# EAGLE design Test_Board (EAGLE 6.5.0)
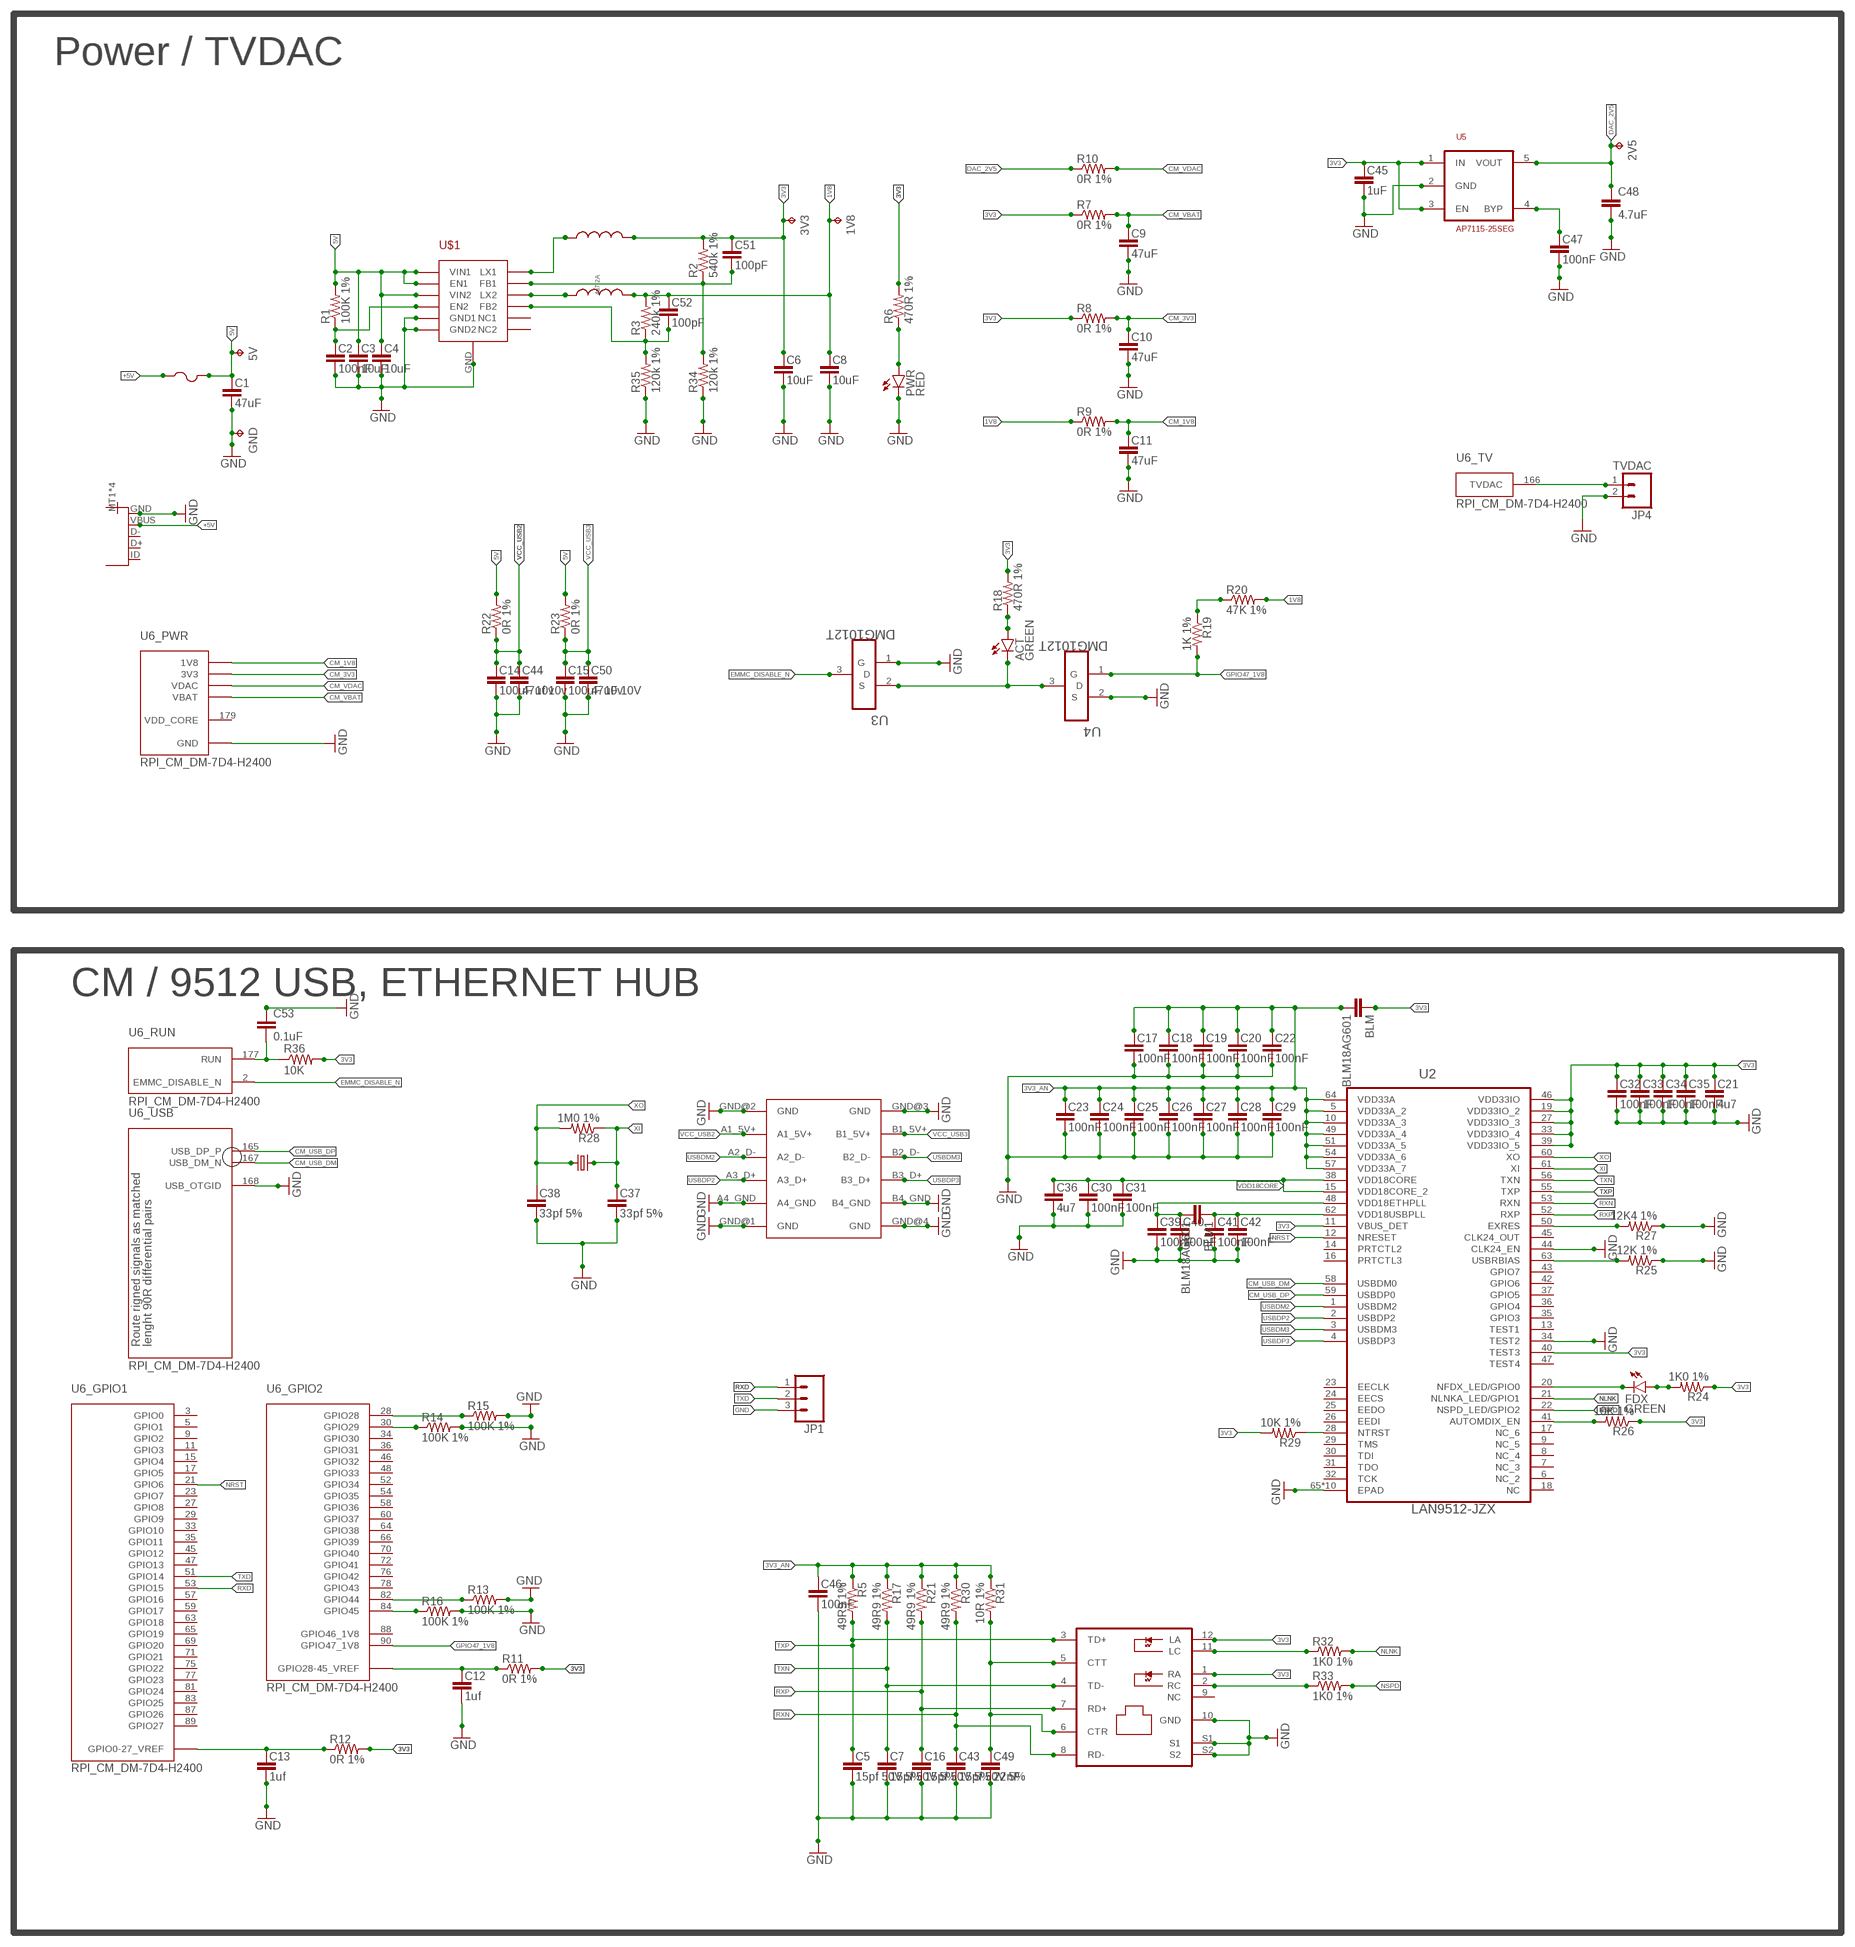
[diagram p0: schematic, sheet 1]

## Parts
1V8  TPB1,27  [B1,27]
2V5  TPB1,27  [B1,27]
3V3  TPB1,27  [B1,27]
5V  TPB1,27  [B1,27]
ACT  GREEN  LED0603  [LED-0603]
BLM  BLM18AG601  0.1UF-25V-5%(0603)  [0603-CAP]
BLM1  BLM18AG601  0.1UF-25V-5%(0603)  [0603-CAP]
C1  47uF  C_1206  [1206]
C2  100nF  C_0402  [0402]
C3  10uF  C_0805  [0805]
C4  10uF  C_0805  [0805]
C5  15pf 50V 5%  C_0402  [0402]
C6  10uF  C_0805  [0805]
C7  15pf 50V 5%  C_0402  [0402]
C8  10uF  C_0805  [0805]
C9  47uF  C_1206  [1206]
C10  47uF  C_1206  [1206]
C11  47uF  C_1206  [1206]
C12  1uf  C_0402  [0402]
C13  1uf  C_0402  [0402]
C14  100uF 10v  C_1206  [1206]
C15  100uF 10v  C_1206  [1206]
C16  15pf 50V 5%  C_0402  [0402]
C17  100nF  C_0402  [0402]
C18  100nF  C_0402  [0402]
C19  100nF  C_0402  [0402]
C20  100nF  C_0402  [0402]
C21  4u7  C_0402  [0402]
C22  100nF  C_0402  [0402]
C23  100nF  C_0402  [0402]
C24  100nF  C_0402  [0402]
C25  100nF  C_0402  [0402]
C26  100nF  C_0402  [0402]
C27  100nF  C_0402  [0402]
C28  100nF  C_0402  [0402]
C29  100nF  C_0402  [0402]
C30  100nF  C_0402  [0402]
C31  100nF  C_0402  [0402]
C32  100nF  C_0402  [0402]
C33  100nF  C_0402  [0402]
C34  100nF  C_0402  [0402]
C35  100nF  C_0402  [0402]
C36  4u7  C_0402  [0402]
C37  33pf 5%  C_0402  [0402]
C38  33pf 5%  C_0402  [0402]
C39  100nF  C_0402  [0402]
C40  100nF  C_0402  [0402]
C41  100nF  C_0402  [0402]
C42  100nF  C_0402  [0402]
C43  15pf 50V 5%  C_0402  [0402]
C44  47uf 10v  C_0805  [0805]
C45  1uF  C_0402  [0402]
C46  100nF  C_0402  [0402]
C47  100nF  C_0402  [0402]
C48  4.7uF  4.7UF-6.3V-10%(0603)0603  [0603-CAP]
C49  22nF  C_0805  [0805]
C50  47uF 10V  C_0805  [0805]
C51  100pF  C_0402  [0402]
C52  100pF  C_0402  [0402]
C53  0.1uF  0.1UF-25V-5%(0603)  [0603-CAP]
F1  PTCFUSE-1812  [1812]
FDX  GREEN  LED0603  [LED-0603]
GND  TPB1,27  [B1,27]
J1  J3011  [J30]
JP1  M03PTH  [1X03]
JP3  USB-IDMICRO  [USB-MICRO]
JP4  TVDAC  M02PTH  [1X02]
L1  4.7u 2A  INDUCTOR-SRN4018  [SRN4018]
L2  4.7u 2A  INDUCTOR-SRN4018  [SRN4018]
PWR  RED  LED0603  [LED-0603]
R1  100K 1%  RESISTOR0402-RES  [0402-RES]
R2  540k 1%  RESISTOR0402-RES  [0402-RES]
R3  240k 1%  RESISTOR0402-RES  [0402-RES]
R5  49R9 1%  RESISTOR0402-RES  [0402-RES]
R6  470R 1%  RESISTOR0402-RES  [0402-RES]
R7  0R 1%  RESISTOR0402-RES  [0402-RES]
R8  0R 1%  RESISTOR0402-RES  [0402-RES]
R9  0R 1%  RESISTOR0402-RES  [0402-RES]
R10  0R 1%  RESISTOR0402-RES  [0402-RES]
R11  0R 1%  RESISTOR0402-RES  [0402-RES]
R12  0R 1%  RESISTOR0402-RES  [0402-RES]
R13  100K 1%  RESISTOR0402-RES  [0402-RES]
R14  100K 1%  RESISTOR0402-RES  [0402-RES]
R15  100K 1%  RESISTOR0402-RES  [0402-RES]
R16  100K 1%  RESISTOR0402-RES  [0402-RES]
R17  49R9 1%  RESISTOR0402-RES  [0402-RES]
R18  470R 1%  RESISTOR0402-RES  [0402-RES]
R19  1K 1%  RESISTOR0402-RES  [0402-RES]
R20  47K 1%  RESISTOR0402-RES  [0402-RES]
R21  49R9 1%  RESISTOR0402-RES  [0402-RES]
R22  0R 1%  RESISTOR0402-RES  [0402-RES]
R23  0R 1%  RESISTOR0402-RES  [0402-RES]
R24  1K0 1%  RESISTOR0402-RES  [0402-RES]
R25  12K 1%  RESISTOR0402-RES  [0402-RES]
R26  10K 1%  RESISTOR0402-RES  [0402-RES]
R27  12K4 1%  RESISTOR0402-RES  [0402-RES]
R28  1M0 1%  RESISTOR0402-RES  [0402-RES]
R29  10K 1%  RESISTOR0402-RES  [0402-RES]
R30  49R9 1%  RESISTOR0402-RES  [0402-RES]
R31  10R 1%  RESISTOR0402-RES  [0402-RES]
R32  1K0 1%  RESISTOR0402-RES  [0402-RES]
R33  1K0 1%  RESISTOR0402-RES  [0402-RES]
R34  120k 1%  RESISTOR0402-RES  [0402-RES]
R35  120k 1%  RESISTOR0402-RES  [0402-RES]
R36  10K  RESISTOR0402-RES  [0402-RES]
U2  LAN9512-JZX  [QFN50P900X900X100-65N]
U3  DMG1012T  [SOT50P160X90-3N]
U4  DMG1012T  [SOT50P160X90-3N]
U5  AP7115-25SEG  74LVC1G79GW  [SOT353]
U6  RPI_CM_DM-7D4-H2400  [JST-DM-200P]
U$1  WDFN-12L  [WDFN-12L]
USB1  72309USB-TYPE-A  [72309]
Y1  CRYSTAL5X3  [CRYSTAL-SMD-5X3]

## Nets
1V8: 1V8.TP C8.1 C52.1 L2.P$2 R3.2 R9.1 R20.2
3V3: 3V3.TP BLM.1 C6.1 C21.1 C32.1 C33.1 C34.1 C35.1 C45.1 C51.1 J1.1(RA) J1.12(LA) L1.P$2 R2.2 R6.2 R7.1 R8.1 R11.2 R12.2 R18.2 R24.1 R26.1 R29.2 R36.2 U2.11(VBUS_DET) U2.19(VDD33IO_2) U2.27(VDD33IO_3) U2.33(VDD33IO_4) U2.39(VDD33IO_5) U2.40(TEST3) U2.46(VDD33IO) U5.1(IN) U5.3(EN)
3V3_AN: BLM.2 C17.1 C18.1 C19.1 C20.1 C22.1 C23.1 C24.1 C25.1 C26.1 C27.1 C28.1 C29.1 C46.1 R5.1 R17.1 R21.1 R30.1 R31.1 U2.5(VDD33A_2) U2.10(VDD33A_3) U2.49(VDD33A_4) U2.51(VDD33A_5) U2.54(VDD33A_6) U2.57(VDD33A_7) U2.64(VDD33A)
5V: 5V.TP C1.1 C3.1 C4.1 F1.2 R1.2 R22.2 R23.2 U$1.1(VIN2) U$1.6(EN1) U$1.7(VIN1)
+5V: F1.1 JP3.VBUS
CM_1V8: C11.1 R9.2 U6.183(_PWR:1V8) U6.184(_PWR:1V8) U6.185(_PWR:1V8) U6.186(_PWR:1V8)
CM_3V3: C10.1 R8.2 U6.191(_PWR:3V3) U6.192(_PWR:3V3) U6.193(_PWR:3V3) U6.194(_PWR:3V3)
CM_USB_DM: U2.58(USBDM0) U6.167(_USB:USB_DM_N)
CM_USB_DP: U2.59(USBDP0) U6.165(_USB:USB_DP_P)
CM_VBAT: C9.1 R7.2 U6.197(_PWR:VBAT) U6.198(_PWR:VBAT) U6.199(_PWR:VBAT) U6.200(_PWR:VBAT)
CM_VDAC: R10.2 U6.189(_PWR:VDAC) U6.190(_PWR:VDAC)
DAC_2V5: 2V5.TP C48.1 R10.1 U5.5(VOUT)
EMMC_DISABLE_N: U3.3(D) U6.2(_RUN:EMMC_DISABLE_N)
GND: C1.2 C2.2 C3.2 C4.2 C5.2 C6.2 C7.2 C8.2 C9.2 C10.2 C11.2 C12.2 C13.2 C14.2 C15.2 C16.2 C17.2 C18.2 C19.2 C20.2 C21.2 C22.2 C23.2 C24.2 C25.2 C26.2 C27.2 C28.2 C29.2 C30.2 C31.2 C32.2 C33.2 C34.2 C35.2 C36.2 C37.2 C38.2 C39.2 C40.2 C41.2 C42.2 C43.2 C44.2 C45.2 C46.2 C47.2 C48.2 C49.2 C50.2 C53.1 GND.TP J1.10(GND) J1.S1 J1.S2 JP1.3 JP3.GND JP4.2 PWR.C R13.2 R14.2 R15.2 R16.2 R25.1 R27.1 R34.1 R35.1 U2.34(TEST2) U2.44(CLK24_EN) U2.65(EPAD) U2.GND@1(EPAD) U2.GND@2(EPAD) U2.GND@3(EPAD) U2.GND@4(EPAD) U2.GND@5(EPAD) U2.GND@6(EPAD) U2.GND@7(EPAD) U2.GND@8(EPAD) U2.GND@9(EPAD) U3.1(G) U4.2(S) U5.2(GND) U6.1(_PWR:GND) U6.7(_PWR:GND) U6.13(_PWR:GND) U6.19(_PWR:GND) U6.25(_PWR:GND) U6.26(_PWR:GND) U6.31(_PWR:GND) U6.32(_PWR:GND) U6.37(_PWR:GND) U6.38(_PWR:GND) U6.43(_PWR:GND) U6.44(_PWR:GND) U6.49(_PWR:GND) U6.50(_PWR:GND) U6.55(_PWR:GND) U6.56(_PWR:GND) U6.61(_PWR:GND) U6.62(_PWR:GND) U6.67(_PWR:GND) U6.68(_PWR:GND) U6.73(_PWR:GND) U6.74(_PWR:GND) U6.79(_PWR:GND) U6.80(_PWR:GND) U6.85(_PWR:GND) U6.86(_PWR:GND) U6.91(_PWR:GND) U6.92(_PWR:GND) U6.97(_PWR:GND) U6.98(_PWR:GND) U6.103(_PWR:GND) U6.104(_PWR:GND) U6.109(_PWR:GND) U6.110(_PWR:GND) U6.115(_PWR:GND) U6.116(_PWR:GND) U6.121(_PWR:GND) U6.122(_PWR:GND) U6.127(_PWR:GND) U6.133(_PWR:GND) U6.134(_PWR:GND) U6.139(_PWR:GND) U6.140(_PWR:GND) U6.145(_PWR:GND) U6.146(_PWR:GND) U6.151(_PWR:GND) U6.152(_PWR:GND) U6.157(_PWR:GND) U6.163(_PWR:GND) U6.164(_PWR:GND) U6.168(_USB:USB_OTGID) U6.169(_PWR:GND) U6.170(_PWR:GND) U6.181(_PWR:GND) U6.182(_PWR:GND) U6.187(_PWR:GND) U6.188(_PWR:GND) U6.195(_PWR:GND) U6.196(_PWR:GND) U$1.3(GND1) U$1.9(GND2) U$1.GND USB1.A4_GND USB1.B4_GND USB1.GND@1(GND) USB1.GND@2(GND) USB1.GND@3(GND) USB1.GND@4(GND)
GPI047_CTL_1V8: R19.1 R20.1
GPIO47_1V8: R19.2 U4.1(G) U6.90(_GPIO2:GPIO47_1V8)
N$1: L1.P$1 U$1.8(LX1)
N$2: C51.2 R2.1 R34.2 U$1.4(FB1)
N$3: C2.1 R1.1 U$1.12(EN2)
N$4: L2.P$1 U$1.2(LX2)
N$5: C12.1 R11.1 U6.41(_GPIO2:GPIO28-45_VREF) U6.42(_GPIO2:GPIO28-45_VREF)
N$6: C52.2 R3.1 R35.2 U$1.10(FB2)
N$7: PWR.A R6.1
N$8: C13.1 R12.1 U6.39(_GPIO1:GPIO0-27_VREF) U6.40(_GPIO1:GPIO0-27_VREF)
N$9: R15.1 U6.28(_GPIO2:GPIO28)
N$10: R14.1 U6.30(_GPIO2:GPIO29)
N$11: R13.1 U6.82(_GPIO2:GPIO44)
N$12: R16.1 U6.84(_GPIO2:GPIO45)
N$13: FDX.A R24.2
N$14: ACT.C U3.2(S) U4.3(D)
N$15: ACT.A R18.1
N$16: R25.2 U2.63(USBRBIAS)
N$17: C53.2 R36.1 U6.177(_RUN:RUN)
N$18: JP4.1 U6.166(_TV:TVDAC)
N$21: C47.1 U5.4(BYP)
N$22: BLM1.1 C41.1 C42.1 U2.62(VDD18USBPLL)
N$23: BLM1.2 C39.1 C40.1 U2.48(VDD18ETHPLL)
N$24: R26.2 U2.41(AUTOMDIX_EN)
N$25: R27.2 U2.50(EXRES)
N$26: R29.1 U2.28(NTRST)
N$27: J1.11(LC) R32.1
N$28: J1.2(RC) R33.1
N$29: C49.1 J1.5(CTT) J1.6(CTR) R31.2
N$30: FDX.C U2.20(NFDX_LED/GPIO0)
NLNK: R32.2 U2.21(NLNKA_LED/GPIO1)
NRST: U2.12(NRESET) U6.21(_GPIO1:GPIO6)
NSPD: R33.2 U2.22(NSPD_LED/GPIO2)
RXD: JP1.1 U6.53(_GPIO1:GPIO15)
RXN: C43.1 J1.8(RD-) R30.2 U2.53(RXN)
RXP: C16.1 J1.7(RD+) R21.2 U2.52(RXP)
TXD: JP1.2 U6.51(_GPIO1:GPIO14)
TXN: C7.1 J1.4(TD-) R17.2 U2.56(TXN)
TXP: C5.1 J1.3(TD+) R5.2 U2.55(TXP)
USBDM2: U2.1(USBDM2) USB1.A2_D-
USBDM3: U2.3(USBDM3) USB1.B2_D-
USBDP2: U2.2(USBDP2) USB1.A3_D+
USBDP3: U2.4(USBDP3) USB1.B3_D+
VCC_USB2: C14.1 C44.1 R22.1 USB1.A1_5V+
VCC_USB3: C15.1 C50.1 R23.1 USB1.B1_5V+
VDD18CORE: C30.1 C31.1 C36.1 U2.15(VDD18CORE_2) U2.38(VDD18CORE)
XI: C37.1 R28.1 U2.61(XI) Y1.3
XO: C38.1 R28.2 U2.60(XO) Y1.1
Unconnected: J1.9(NC) JP3.D+ JP3.D- JP3.ID JP3.MT1(SHELL) JP3.MT2(SHELL) JP3.P$1(SHELL) JP3.P$2(SHELL) U2.6(NC_2) U2.7(NC_3) U2.8(NC_4) U2.9(NC_5) U2.13(TEST1) U2.14(PRTCTL2) U2.16(PRTCTL3) U2.17(NC_6) U2.18(NC) U2.23(EECLK) U2.24(EECS) U2.25(EEDO) U2.26(EEDI) U2.29(TMS) U2.30(TDI) U2.31(TDO) U2.32(TCK) U2.35(GPIO3) U2.36(GPIO4) U2.37(GPIO5) U2.42(GPIO6) U2.43(GPIO7) U2.45(CLK24_OUT) U2.47(TEST4) U6.3(_GPIO1:GPIO0) U6.5(_GPIO1:GPIO1) U6.9(_GPIO1:GPIO2) U6.11(_GPIO1:GPIO3) U6.15(_GPIO1:GPIO4) U6.17(_GPIO1:GPIO5) U6.23(_GPIO1:GPIO7) U6.27(_GPIO1:GPIO8) U6.29(_GPIO1:GPIO9) U6.33(_GPIO1:GPIO10) U6.34(_GPIO2:GPIO30) U6.35(_GPIO1:GPIO11) U6.36(_GPIO2:GPIO31) U6.45(_GPIO1:GPIO12) U6.46(_GPIO2:GPIO32) U6.47(_GPIO1:GPIO13) U6.48(_GPIO2:GPIO33) U6.52(_GPIO2:GPIO34) U6.54(_GPIO2:GPIO35) U6.57(_GPIO1:GPIO16) U6.58(_GPIO2:GPIO36) U6.59(_GPIO1:GPIO17) U6.60(_GPIO2:GPIO37) U6.63(_GPIO1:GPIO18) U6.64(_GPIO2:GPIO38) U6.65(_GPIO1:GPIO19) U6.66(_GPIO2:GPIO39) U6.69(_GPIO1:GPIO20) U6.70(_GPIO2:GPIO40) U6.71(_GPIO1:GPIO21) U6.72(_GPIO2:GPIO41) U6.75(_GPIO1:GPIO22) U6.76(_GPIO2:GPIO42) U6.77(_GPIO1:GPIO23) U6.78(_GPIO2:GPIO43) U6.81(_GPIO1:GPIO24) U6.83(_GPIO1:GPIO25) U6.87(_GPIO1:GPIO26) U6.88(_GPIO2:GPIO46_1V8) U6.89(_GPIO1:GPIO27) U6.93(_DSI:DSI0_D1_N) U6.94(_DSI:DSI1_D0_P) U6.95(_DSI:DSI0_D1_P) U6.96(_DSI:DSI1_D0_N) U6.99(_DSI:DSI0_D0_N) U6.100(_DSI:DSI1_C_P) U6.101(_DSI:DSI0_D0_P) U6.102(_DSI:DSI1_C_N) U6.105(_DSI:DSI0_C_N) U6.106(_DSI:DSI1_D3_P) U6.107(_DSI:DSI0_C_P) U6.108(_DSI:DSI1_D3_N) U6.111(_HDMI:HDMI_CK_N) U6.112(_DSI:DSI1_D2_P) U6.113(_HDMI:HDMI_CK_P) U6.114(_DSI:DSI1_D2_N) U6.117(_HDMI:HDMI_D0_N) U6.118(_DSI:DSI1_D1_P) U6.119(_HDMI:HDMI_D0_P) U6.120(_DSI:DSI1_D1_N) U6.123(_HDMI:HDMI_D1_N) U6.125(_HDMI:HDMI_D1_P) U6.129(_HDMI:HDMI_D2_N) U6.131(_HDMI:HDMI_D2_P) U6.135(_CAM:CAM1_D3_P) U6.136(_CAM:CAM0_D0_P) U6.137(_CAM:CAM1_D3_N) U6.138(_CAM:CAM0_D0_N) U6.141(_CAM:CAM1_D2_P) U6.142(_CAM:CAM0_C_P) U6.143(_CAM:CAM1_D2_N) U6.144(_CAM:CAM0_C_N) U6.147(_CAM:CAM1_C_P) U6.148(_CAM:CAM0_D1_P) U6.149(_CAM:CAM1_C_N) U6.150(_CAM:CAM0_D1_N) U6.153(_CAM:CAM1_D1_P) U6.155(_CAM:CAM1_D1_N) U6.159(_CAM:CAM1_D0_P) U6.161(_CAM:CAM1_D0_N) U6.171(_HDMI:HDMI_CEC) U6.172(_JTAG:VC_TSRT_N) U6.173(_HDMI:HDMI_SDA) U6.174(_JTAG:VC_TDI) U6.175(_HDMI:HDMI_SCL) U6.176(_JTAG:VC_TMS) U6.178(_JTAG:VC_TDO) U6.179(_PWR:VDD_CORE) U6.180(_JTAG:VC_TCK) U$1.5(NC1) U$1.11(NC2)

## Notes on the sheet
- Power / TVDAC
- CM / 9512 USB, ETHERNET HUB

## Library data of the parts
1V8 2V5 3V3 5V GND = testpad:TP: Test pad
ACT FDX PWR = SparkFun-LED:LED: LEDs Standard schematic elements and footprints for 5mm, 3mm, 1206, and 0603 sized LEDs. 5mm - Spark Fun Electronics SKU : COM-00529 (and others)
BLM BLM1 = SparkFun-Capacitors:0.1UF-25V-5%(0603): CAP-08604; PROD_ID: CAP-08604; VALUE: 0.1uF
C1 C2 C5 C7 C9-C43 C45-C47 C51 C52 = C:C
C3 C4 C6 C8 C44 C49 C50 = C:C; MN: TDK Corp.; PARTNO: C2012X5R1Cxxxxxxx; VID: DK
C48 = SparkFun-Capacitors:4.7UF-6.3V-10%(0603): CAP-08280; PROD_ID: CAP-08280
C53 = SparkFun-Capacitors:0.1UF-25V-5%(0603): CAP-08604; PROD_ID: CAP-08604
F1 = PTCFUSE:PTCFUSE
J1 = J3011:J3011
JP1 = SparkFun-Connectors:M03: Header 3 Standard 3-pin 0.1" header. Use with straight break away headers (SKU : PRT-00116), right angle break away headers (PRT-00553), swiss pins (PRT-00743), machine pins (PRT-00117), and female headers (PRT-00115). Molex polarized connector foot print use with SKU : PRT-08232 with associated crimp pins and housings.
JP3 = USB-ID:USB-ID; PROD_ID: CONN-09505
JP4 = SparkFun-Connectors:M02: Standard 2-pin 0.1" header. Use with - straight break away headers ( PRT-00116) - right angle break away headers (PRT-00553) - swiss pins (PRT-00743) - machine pins (PRT-00117) - female headers (PRT-00115) Molex polarized connector foot print use with: PRT-08233 with associated crimp pins and housings. 2.54_SCREWTERM for use with PRT-10571. 3.5mm Screw Terminal footprints for PRT-08084 5mm Screw Terminal footprints for use with PRT-08433
L1 = INDUCTOR:INDUCTOR
L2 = INDUCTOR:INDUCTOR; L2: 4u7 2A
R1-R3 R5-R35 = RESISTORS:RESISTOR
R36 = SparkFun-Passives:RESISTOR: Resistor Basic schematic elements and footprints for 0603, 1206, and PTH resistors.
U2 = LAN9512:LAN9512-JZX: IC, USB2 - ENET CNTRL 2-PORT HUB, 64VQFN; MPN: LAN9512-JZX; OC_FARNELL: 2292586; OC_NEWARK: 66W1988; PACKAGE: 64VQFN; SUPPLIER: Microchip
U3 U4 = DMG1012-T:DMG1012T: TRANSISTOR; MPN: DMG1012T; PACKAGE: SOT-523-3; SUPPLIER: Diodes Inc
U5 = AP7115-25SEG:74LVC1G79
U6 = Compute Module:RPI_CM: Raspberry Pi Compute Module As anounced in this blog post http://www.raspberrypi.org/raspberry-pi-compute-module-new-product/ Based on infomation from this schematic http://www.raspberrypi.org/wp-content/uploads/2014/04/RPI-CM-V1_1-SCHEMATIC.pdf Footprint is unproven and no matching part confimed as of yet
U$1 = PAM2306AY:WDFN-12L: PAM2306AY
USB1 = 72309:72309
Y1 = CRYSTAL:CRYSTAL

## Board
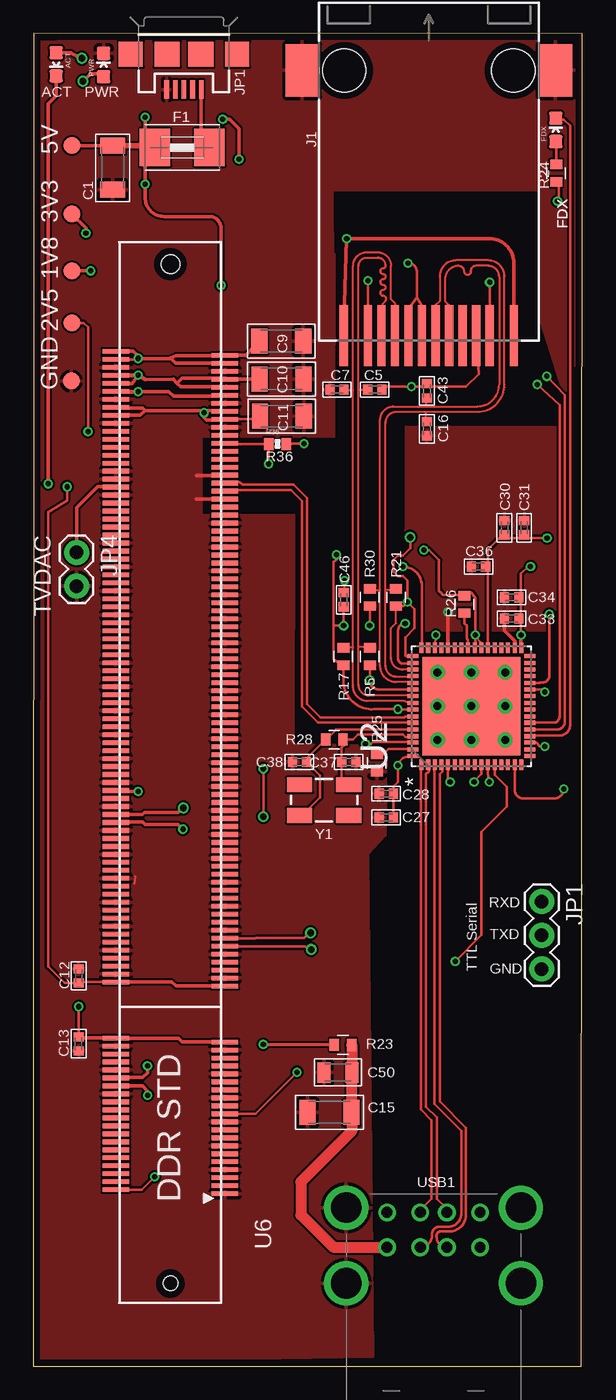
[diagram p1: board, top side]
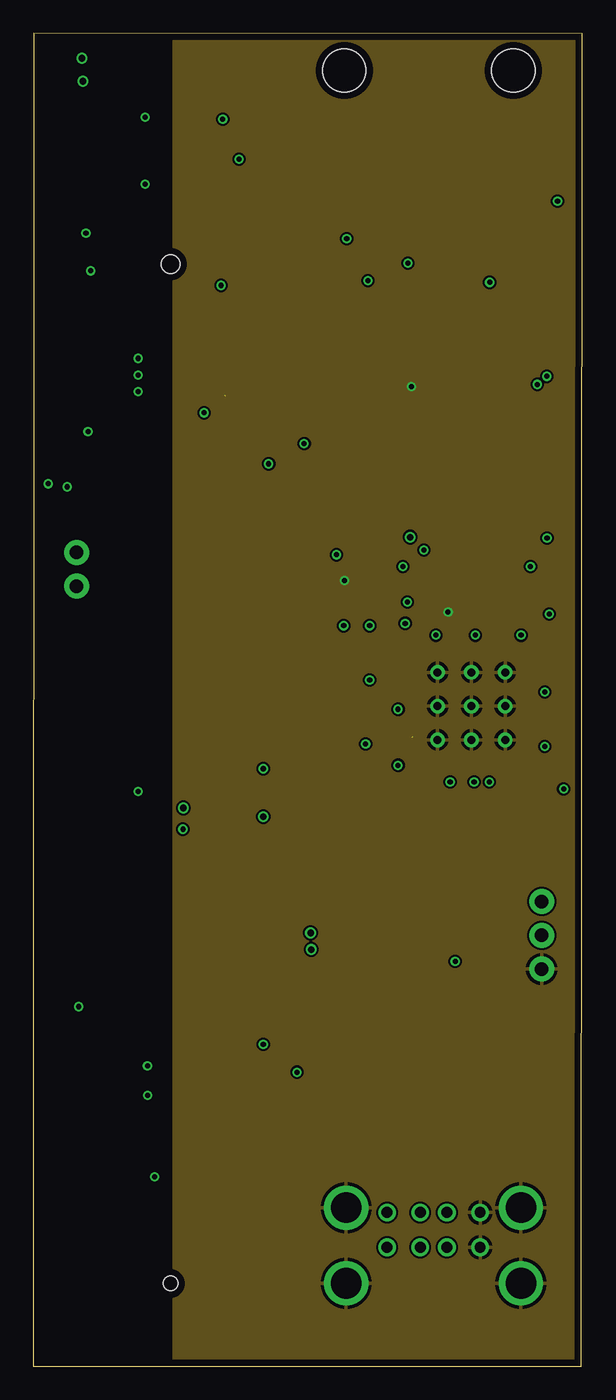
[diagram p2: board, inner layer Route2]
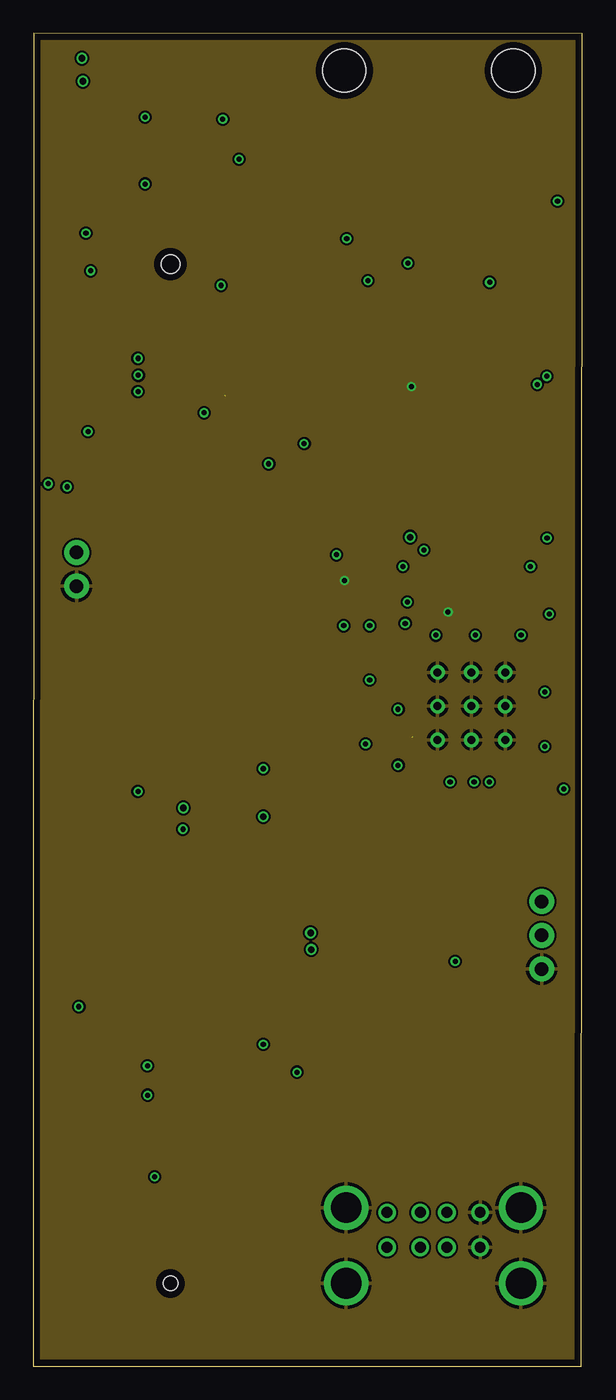
[diagram p3: board, inner layer Route15]
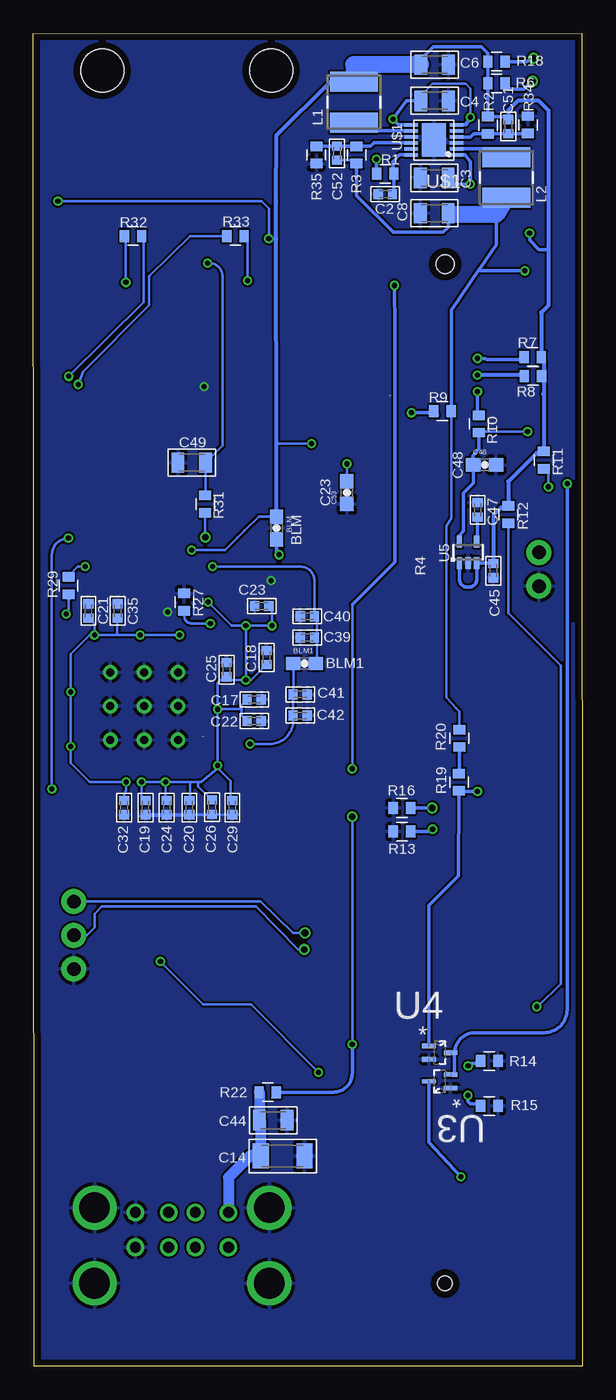
[diagram p4: board, bottom side, seen from below]

Size 41.28 x 100.18 mm. Coordinates in mm from the lower left corner, seen from the top.
Outline: 0,0 41.2,0 41.28,100.15 0.05,100.18 0,0
Copper layers (1+2*15+16): Top 0.035mm / dielectric 0.12mm / Route2 0.035mm / dielectric 0.6mm / Route15 0.035mm / dielectric 0.12mm / Bottom 0.035mm
Design rules "EagleRules *": minimum track width 6mil, minimum drill 12mil, track to track 6mil, track to pad 7mil, pad to pad 7mil, via to via 7mil, smd to smd 0mil, copper to edge 20mil, drill to drill 10mil, minimum pad ring 10mil, minimum via ring 6mil, stop-mask expansion 2mil, vias tented up to drill 25mil, thermal gap 10mil

### Footprints (pad centres in the part's own frame; a part is rotated, then mirrored left to right if it is on the bottom)
B1,27 = smd 1.27 x 1.27: TP 0,0
LED-0603 = smd 1 x 1: A 0,-0.877; C 0,0.877
0603-CAP = smd 1.1 x 1: 1 -0.85,0; 2 0.85,0
1206 = smd 1.219 x 1.88: 1 -1.651,0; 2 1.651,0
0402 = smd 0.686 x 0.762: 1 -0.533,0; 2 0.533,0
0805 = smd 0.965 x 1.524: 1 -1.041,0; 2 1.041,0
1812 = smd 2.286 x 2.794: 1 -2.046,0; 2 2.046,0
J30 = smd 0.61 x 4.597: 1 -6.401,-19.939; 2 -4.572,-19.939; 3 -3.556,-19.939; 4 -2.54,-19.939; 5 -1.524,-19.939; 6 -0.508,-19.939; 7 0.508,-19.939; 8 1.524,-19.939; 9 2.54,-19.939; 10 3.556,-19.939; 11 4.572,-19.939; 12 6.401,-19.939 | smd 2.489 x 3.912: S1 -9.525,0; S2 9.525,0 | hole 3.251: 6.35,0; -6.35,0
1X03 = drill 1.016 pad 1.88: 1 0,0; 2 2.54,0; 3 5.08,0
USB-MICRO = smd 0.35 x 1.4: D+ 0,2.65; D- -0.65,2.65; GND 1.3,2.65; ID 0.65,2.65; VBUS -1.3,2.65 | smd 1.8 x 1.9: MT1 -4,0; MT2 4,0 | smd 1.9 x 1.9: P$1 -1.27,0; P$2 1.27,0
1X02 = drill 1.016 pad 1.88: 1 0,0; 2 2.54,0
SRN4018 = smd 1.5 x 3.6: P$1 -1.525,0; P$2 1.525,0
0402-RES = smd 0.7 x 0.9: 1 -0.65,0; 2 0.65,0
QFN50P900X900X100-65N = smd 0.813 x 0.305: 1 -4.394,3.759; 2 -4.394,3.251; 3 -4.394,2.743; 4 -4.394,2.261; 5 -4.394,1.753; 6 -4.394,1.245; 7 -4.394,0.762; 8 -4.394,0.254; 9 -4.394,-0.254; 10 -4.394,-0.762; 11 -4.394,-1.245; 12 -4.394,-1.753; 13 -4.394,-2.261; 14 -4.394,-2.743; 15 -4.394,-3.251; 16 -4.394,-3.759; 33 4.394,-3.759; 34 4.394,-3.251; 35 4.394,-2.743; 36 4.394,-2.261; 37 4.394,-1.753; 38 4.394,-1.245; 39 4.394,-0.762; 40 4.394,-0.254; 41 4.394,0.254; 42 4.394,0.762; 43 4.394,1.245; 44 4.394,1.753; 45 4.394,2.261; 46 4.394,2.743; 47 4.394,3.251; 48 4.394,3.759 | smd 0.305 x 0.813: 17 -3.759,-4.394; 18 -3.251,-4.394; 19 -2.743,-4.394; 20 -2.261,-4.394; 21 -1.753,-4.394; 22 -1.245,-4.394; 23 -0.762,-4.394; 24 -0.254,-4.394; 25 0.254,-4.394; 26 0.762,-4.394; 27 1.245,-4.394; 28 1.753,-4.394; 29 2.261,-4.394; 30 2.743,-4.394; 31 3.251,-4.394; 32 3.759,-4.394; 49 3.759,4.394; 50 3.251,4.394; 51 2.743,4.394; 52 2.261,4.394; 53 1.753,4.394; 54 1.245,4.394; 55 0.762,4.394; 56 0.254,4.394; 57 -0.254,4.394; 58 -0.762,4.394; 59 -1.245,4.394; 60 -1.753,4.394; 61 -2.261,4.394; 62 -2.743,4.394; 63 -3.251,4.394; 64 -3.759,4.394 | smd 7.391 x 7.391: 65 0,0 | drill 0.6: GND@1 -2.54,2.54; GND@2 0,2.54; GND@3 2.54,2.54; GND@4 -2.54,0; GND@5 0,0; GND@6 2.54,0; GND@7 -2.54,-2.54; GND@8 0,-2.54; GND@9 2.54,-2.54
SOT50P160X90-3N = smd 1.016 x 0.356: 1 -0.813,0.508; 2 -0.813,-0.508 | smd 1.016 x 0.305: 3 0.813,0
SOT353 = smd 0.4 x 0.9: 1 -0.65,-0.8; 2 0,-0.8; 3 0.65,-0.8; 4 0.65,0.8; 5 -0.65,0.8
JST-DM-200P = smd 0.35 x 2: 1 -32.65,-4.1; 2 -32.35,4.1; 3 -32.05,-4.1; 4 -31.75,4.1; 5 -31.45,-4.1; 6 -31.15,4.1; 7 -30.85,-4.1; 8 -30.55,4.1; 9 -30.25,-4.1; 10 -29.95,4.1; 11 -29.65,-4.1; 12 -29.35,4.1; 13 -29.05,-4.1; 14 -28.75,4.1; 15 -28.45,-4.1; 16 -28.15,4.1; 17 -27.85,-4.1; 18 -27.55,4.1; 19 -27.25,-4.1; 20 -26.95,4.1; 21 -26.65,-4.1; 22 -26.35,4.1; 23 -26.05,-4.1; 24 -25.75,4.1; 25 -25.45,-4.1; 26 -25.15,4.1; 27 -24.85,-4.1; 28 -24.55,4.1; 29 -24.25,-4.1; 30 -23.95,4.1; 31 -23.65,-4.1; 32 -23.35,4.1; 33 -23.05,-4.1; 34 -22.75,4.1; 35 -22.45,-4.1; 36 -22.15,4.1; 37 -21.85,-4.1; 38 -21.55,4.1; 39 -21.25,-4.1; 40 -20.95,4.1; 41 -17.05,-4.1; 42 -16.75,4.1; 43 -16.45,-4.1; 44 -16.15,4.1; 45 -15.85,-4.1; 46 -15.55,4.1; 47 -15.25,-4.1; 48 -14.95,4.1; 49 -14.65,-4.1; 50 -14.35,4.1; 51 -14.05,-4.1; 52 -13.75,4.1; 53 -13.45,-4.1; 54 -13.15,4.1; 55 -12.85,-4.1; 56 -12.55,4.1; 57 -12.25,-4.1; 58 -11.95,4.1; 59 -11.65,-4.1; 60 -11.35,4.1; 61 -11.05,-4.1; 62 -10.75,4.1; 63 -10.45,-4.1; 64 -10.15,4.1; 65 -9.85,-4.1; 66 -9.55,4.1; 67 -9.25,-4.1; 68 -8.95,4.1; 69 -8.65,-4.1; 70 -8.35,4.1; 71 -8.05,-4.1; 72 -7.75,4.1; 73 -7.45,-4.1; 74 -7.15,4.1; 75 -6.85,-4.1; 76 -6.55,4.1; 77 -6.25,-4.1; 78 -5.95,4.1; 79 -5.65,-4.1; 80 -5.35,4.1; 81 -5.05,-4.1; 82 -4.75,4.1; 83 -4.45,-4.1; 84 -4.15,4.1; 85 -3.85,-4.1; 86 -3.55,4.1; 87 -3.25,-4.1; 88 -2.95,4.1; 89 -2.65,-4.1; 90 -2.35,4.1; 91 -2.05,-4.1; 92 -1.75,4.1; 93 -1.45,-4.1; 94 -1.15,4.1; 95 -0.85,-4.1; 96 -0.55,4.1; 97 -0.25,-4.1; 98 0.05,4.1; 99 0.35,-4.1; 100 0.65,4.1; 101 0.95,-4.1; 102 1.25,4.1; 103 1.55,-4.1; 104 1.85,4.1; 105 2.15,-4.1; 106 2.45,4.1; 107 2.75,-4.1; 108 3.05,4.1; 109 3.35,-4.1; 110 3.65,4.1; 111 3.95,-4.1; 112 4.25,4.1; 113 4.55,-4.1; 114 4.85,4.1; 115 5.15,-4.1; 116 5.45,4.1; 117 5.75,-4.1; 118 6.05,4.1; 119 6.35,-4.1; 120 6.65,4.1; 121 6.95,-4.1; 122 7.25,4.1; 123 7.55,-4.1; 124 7.85,4.1; 125 8.15,-4.1; 126 8.45,4.1; 127 8.75,-4.1; 128 9.05,4.1; 129 9.35,-4.1; 130 9.65,4.1; 131 9.95,-4.1; 132 10.25,4.1; 133 10.55,-4.1; 134 10.85,4.1; 135 11.15,-4.1; 136 11.45,4.1; 137 11.75,-4.1; 138 12.05,4.1; 139 12.35,-4.1; 140 12.65,4.1; 141 12.95,-4.1; 142 13.25,4.1; 143 13.55,-4.1; 144 13.85,4.1; 145 14.15,-4.1; 146 14.45,4.1; 147 14.75,-4.1; 148 15.05,4.1; 149 15.35,-4.1; 150 15.65,4.1; 151 15.95,-4.1; 152 16.25,4.1; 153 16.55,-4.1; 154 16.85,4.1; 155 17.15,-4.1; 156 17.45,4.1; 157 17.75,-4.1; 158 18.05,4.1; 159 18.35,-4.1; 160 18.65,4.1; 161 18.95,-4.1; 162 19.25,4.1; 163 19.55,-4.1; 164 19.85,4.1; 165 20.15,-4.1; 166 20.45,4.1; 167 20.75,-4.1; 168 21.05,4.1; 169 21.35,-4.1; 170 21.65,4.1; 171 21.95,-4.1; 172 22.25,4.1; 173 22.55,-4.1; 174 22.85,4.1; 175 23.15,-4.1; 176 23.45,4.1; 177 23.75,-4.1; 178 24.05,4.1; 179 24.35,-4.1; 180 24.65,4.1; 181 24.95,-4.1; 182 25.25,4.1; 183 25.55,-4.1; 184 25.85,4.1; 185 26.15,-4.1; 186 26.45,4.1; 187 26.75,-4.1; 188 27.05,4.1; 189 27.35,-4.1; 190 27.65,4.1; 191 27.95,-4.1; 192 28.25,4.1; 193 28.55,-4.1; 194 28.85,4.1; 195 29.15,-4.1; 196 29.45,4.1; 197 29.75,-4.1; 198 30.05,4.1; 199 30.35,-4.1; 200 30.65,4.1 | hole 1.4: 37.2,0 | hole 1.1: -39.4,0
WDFN-12L = smd 1 x 0.25: 1 -2.2,3.6; 2 -2.2,3.15; 3 -2.2,2.7; 4 -2.2,2.25; 5 -2.2,1.8; 6 -2.2,1.35; 7 1.2,1.35; 8 1.2,1.8; 9 1.2,2.25; 10 1.2,2.7; 11 1.2,3.15; 12 1.2,3.6 | smd 1.8 x 2.525: GND -0.5,2.48
72309 = drill 0.813: A1_5V+ -3.5,2.62; A2_D- -1,2.62; A3_D+ 1,2.62; A4_GND 3.5,2.62; B1_5V+ -3.5,0; B2_D- -1,0; B3_D+ 1,0; B4_GND 3.5,0 | drill 2.3: GND@1 -6.57,2.97; GND@2 -6.57,-2.71; GND@3 6.57,-2.71; GND@4 6.57,2.97
CRYSTAL-SMD-5X3 = smd 1.9 x 1.1: 1 -1.85,-1.15; 2 1.85,-1.15; 3 1.85,1.15; 4 -1.85,1.15

### Placement (x,y rotation side)
1V8  2.9,82.32 90 top
2V5  2.9,78.41 90 top
3V3  2.9,86.59 90 top
5V  2.9,91.74 90 top
ACT  1.73,97.84 180 top
BLM  22.99,62.99 270 bottom
BLM1  20.88,52.81 0 bottom
C1  5.97,90.07 270 top
C2  14.81,88.09 180 bottom
C3  11.13,89.31 180 bottom
C4  11.1,95.1 0 bottom
C5  25.68,73.41 0 top
C6  11.1,97.82 0 bottom
C7  22.83,73.41 180 top
C8  11.13,86.66 180 bottom
C9  18.64,77.04 0 top
C10  18.67,74.19 0 top
C11  18.69,71.4 0 top
C12  3.43,29.34 90 top
C13  3.4,24.23 270 top
C14  22.53,15.8 0 bottom
C15  22.28,19.08 180 top
C16  29.59,70.46 270 top
C17  24.66,50.11 0 bottom
C18  23.75,53.26 90 bottom
C19  32.84,41.99 270 bottom
C20  29.54,41.99 270 bottom
C21  37.13,56.77 90 bottom
C22  24.66,48.49 0 bottom
C23  24.1,57.12 180 bottom
C24  31.24,41.99 270 bottom
C25  26.75,52.35 90 bottom
C26  27.84,42.01 270 bottom
C27  26.54,41.25 180 top
C28  26.54,43.03 180 top
C29  26.31,41.99 270 bottom
C30  35.43,63.02 90 top
C31  36.91,63.02 90 top
C32  34.44,41.99 270 bottom
C33  35.97,56.18 180 top
C34  35.97,57.78 180 top
C35  34.93,56.77 90 bottom
C36  33.48,60.1 180 top
C37  23.72,45.42 0 top
C38  20.02,45.42 180 top
C39  20.68,54.76 180 bottom
C40  20.68,56.36 180 bottom
C41  21.21,50.5 0 bottom
C42  21.21,48.9 0 bottom
C43  29.59,73.3 90 top
C44  23.24,18.49 0 bottom
C45  6.68,59.79 270 bottom
C46  23.34,57.61 90 top
C47  7.87,64.36 90 bottom
C48  7.34,67.74 0 bottom
C49  29.36,67.92 180 bottom
C50  22.91,22.07 180 top
C51  5.56,93.17 270 bottom
C52  18.44,91.16 90 bottom
C53  17.7,65.66 90 bottom
F1  11.2,91.59 180 top
FDX  39.29,92.91 0 top
GND  2.87,74.04 90 top
J1  29.74,97.38 0 top
JP1  38.23,34.92 270 top
JP3  11.33,98.6 180 top
JP4  3.25,61.16 270 top
L1  17.17,95 90 bottom
L2  5.71,89.33 270 bottom
PWR  5.28,97.79 0 top
R1  14.81,89.61 180 bottom
R2  7.09,93.27 90 bottom
R3  16.97,91.03 270 bottom
R5  25.3,53.34 90 top
R6  6.45,96.42 180 bottom
R7  3.73,75.84 180 bottom
R8  3.71,74.42 180 bottom
R9  10.52,71.78 180 bottom
R10  7.77,70.82 90 bottom
R11  2.9,68.1 90 bottom
R12  5.56,64.01 90 bottom
R13  13.56,40.18 180 bottom
R14  6.99,22.94 0 bottom
R15  6.99,19.56 0 bottom
R16  13.56,41.96 180 bottom
R17  23.32,53.34 90 top
R18  6.45,98.04 180 bottom
R19  9.27,43.89 270 bottom
R20  9.25,47.19 90 bottom
R21  27.28,57.78 90 top
R22  23.65,20.6 0 bottom
R23  23.29,24.16 180 top
R24  39.32,89.66 90 top
R25  25.83,45.34 90 top
R26  32.41,57.25 270 top
R27  29.92,57.43 270 bottom
R28  22.63,47.09 180 top
R29  38.63,58.67 90 bottom
R30  25.3,57.78 90 top
R31  28.35,64.8 90 bottom
R32  33.78,84.94 0 bottom
R33  26.09,84.94 180 bottom
R34  4.09,93.29 270 bottom
R35  19.99,91.03 90 bottom
R36  18.36,69.32 0 top
U2  32.94,49.61 90 top
U3  10.72,21.41 180 bottom
U4  10.72,23.57 0 bottom
U5  8.59,61.16 0 bottom
U6  10.31,45.62 90 top
U$1  11.66,94.64 180 bottom
USB1  30.1,8.94 0 top
Y1  21.87,42.55 0 top

### Tracks (layer width: path | path; a pad name or v marks a point on that pad's centre or on a via)
1V8  (via drill 0.38)
  Top 0.254: 1V8.TP v4.32,82.32
  Bottom 0.203: R9.1 9.86,71.49 9.86,63.75 10.21,63.14 10.21,50.24 9.47,49.43 9.26,49.19 R20.2 | C52.1 16.97,90.63 R3.2
  Bottom 0.254: R9.1 9.86,71.72 9.86,79.38 7.78,82.39 | 7.78,82.39 7.7,82.5 6.45,84.28 6.48,86.56 | 7.78,82.39 7.7,82.32 v4.32,82.32 | 9.91,86.56 arc-90 10.01,86.67 C8.1 10.08,85.62 10.49,85.22 14.2,85.22 16.97,87.99 R3.2
  Bottom 1.27: L2.P$2 6.48,86.56 9.91,86.56
3V3  (via drill 0.38)
  Top 0.152: v30.28,54.94 30.28,54.59 30.2,54.51 U2.46
  Top 0.178: 30.63,58.14 30.81,57.96 32.41,57.96 R26.1 | v34.29,43.92 34.19,44.53 U2.11 | U2.39 33.66,54.05 33.66,54.41 33.3,54.76 v33.25,54.94 33.25,54.1 U2.40 | v20.37,69.34 19.02,69.34 R36.2
  Top 0.203: R26.1 32.83,58.14 32.94,58.14 33.25,57.73 v33.25,54.94 | v36.68,54.94 36.68,56.01 | 36.68,56.01 36.68,57.61 | 36.68,57.61 36.68,59.56 37.21,60.1 v37.39,60.1 | C33.1 36.68,56.01 | C34.1 36.68,57.61 | U2.27 38.28,50.85 v38.46,50.67 | v38.46,46.58 38.1,46.58 37.82,46.86 37.47,46.86 37.39,46.81 U2.19 | 36.68,53.95 36.7,53.98 U2.33 | 30.63,58.14 30.51,58.27 30.51,60.58 29.74,61.34 v29.36,61.34 | R24.1 39.32,88.8 39.5,88.8 39.5,87.55 v39.42,87.55
  Top 0.254: 36.68,53.95 v36.68,54.94 | 3V3.TP 3.96,85.52 v3.96,85.17 | J1.12 36.14,82.91 arc90 34.32,84.73 v23.57,84.73 23.55,84.71 J1.1
  Bottom 0.178: v34.29,43.92 37.03,43.92 38.46,45.34 v38.46,46.58 v38.46,50.67 38.46,53.52 37.03,54.94 v36.68,54.94 34.98,54.94 v33.25,54.94 v30.28,54.94 | 22.99,69.34 22.86,69.34 v20.37,69.34
  Bottom 0.203: v37.39,60.1 37.92,60.1 38.63,59.38 R29.2 | C21.1 36.68,55.78 v36.68,54.94 | C35.1 34.98,56.34 34.98,54.94 | v29.36,61.34 26.85,61.34 25.91,62.28 25.37,62.79 24.32,63.84 BLM.1 | v39.42,87.55 24.13,87.55 23.57,87 v23.57,84.73 | v34.29,43.92 34.29,43.28 34.44,43.03 C32.1
  Bottom 0.254: R7.1 2.9,75.66 2.9,75.56 | R8.1 2.96,74.32 2.9,74.32 | 2.93,73.08 2.9,73.08 | U5.3 7.87,60.3 | 9.3,60.3 U5.1 arc-90 U5.1 9.25,59.18 arc-90 8.61,58.55 8.56,58.55 arc-90 7.92,59.18 7.92,60.35 arc-90 U5.3 | v3.96,85.17 3.96,84.63 3.25,83.92 2.54,83.92 | 23.01,84.73 v23.57,84.73 | C45.1 arc-90 6.72,60.36 U5.3 | C6.1 12.14,98.22 11.2,99.16 7.59,99.16 7.1,98.67 R18.2 R6.2 7.09,96.4 R2.2 5.78,93.92 C51.1
  Bottom 0.305: 2.9,75.56 2.9,74.32 2.9,73.08 | BLM.1 22.99,69.34 23.01,84.73 23.01,87.63 22.99,92.53 18.92,96.52 L1.P$2 | 2.93,73.08 2.9,73.04 R11.2 3.01,68.63 3.43,68.63 5.56,66.5 R12.2 5.68,64.54 6.1,64.54 6.68,63.98 C45.1 | C51.1 5.56,94.39 4.85,95.1 3.28,95.1 2.54,94.39 2.54,83.92 2.57,83.9 2.57,79.7 3.08,79.19 R7.1
  Bottom 1.27: C6.1 17.17,97.81 L1.P$2
3V3_AN  (via drill 0.38, 0.5)
  Top 0.152: U2.51 27.79,52.35 arc-90 26.9,53.24 26.9,55.47 27.28,55.85 R21.1
  Top 0.178: 28.5,50.85 26.01,50.85 arc-90 v25.3,51.56 R5.1 | R30.1 v25.3,55.65 | C46.1 v23.34,55.65 22.58,55.65 | v28.14,57.43 28.14,59.03 27.79,59.38 27.43,59.38 27.08,59.74 27.08,60.6 27.41,60.94 27.79,60.94 28.35,61.49 v28.35,62.31 | 28.45,53.34 28.14,53.34 arc-90 27.97,53.52 27.97,54.76 28.68,55.47 28.68,56.9 v28.14,57.43 | R21.1 27.85,57.13 v28.14,57.43 | 22.58,55.65 22.58,53.16 22.99,52.81 23.16,52.81 23.34,52.63 23.4,52.69 R17.1 23.32,51.38 arc90 25.63,49.38 27.38,49.38 | v33.15,43.92 33.71,44.5 U2.10 | v31.34,43.92 31.17,44.22 31.17,45.11 31.19,45.14 U2.5 | 28.24,45.87 27.79,45.7 27.43,45.34 v27.43,45.16 | U2.57 27.46,49.35 arc-90 v27.43,49.38 | 22.58,55.65 22.58,60.45 22.81,60.63 v22.81,60.98
  Top 0.203: C27.1 C28.1 27.08,43.56 27.43,43.92 v27.43,45.16 | 28.45,53.34 28.47,53.37 U2.49 | U2.54 28.5,50.85 | 28.24,45.87 28.55,45.82 U2.64
  Bottom 0.178: v25.3,55.65 v25.3,51.56 | v25.3,55.65 v23.34,55.65 | v28.14,57.43 26.37,55.65 v25.3,55.65 | v33.15,43.92 v31.34,43.92 29.49,43.92 28.88,43.92 28.68,43.92 27.43,44.91 v27.43,45.16 v27.43,49.38 27.43,51.36 27.23,51.56 26.8,51.56 | 25.65,51.56 v25.3,51.56 | 26.8,51.56 v25.3,51.56 | C25.1 26.8,51.77 26.8,51.56 | v28.35,62.31 R31.1
  Bottom 0.203: C17.1 25.63,49.68 25.63,49.38 | 25.63,49.38 v27.43,49.38 | C22.1 25.63,48.92 25.63,49.38 | C23.1 23.6,57.05 23.34,57.05 v23.34,55.65 | C18.1 24.92,51.56 v25.3,51.56 | C20.1 29.49,42.57 29.49,43.92 | C26.1 28.88,43.59 28.88,43.92 | C24.1 31.34,42.62 v31.34,43.92 | C19.1 33.15,42.52 v33.15,43.92 | C29.1 26.44,42.65 26.44,43.97 27.43,44.96 v27.43,45.16
  Bottom 0.254: BLM.2 22.99,61.16 v22.81,60.98
5V  (via drill 0.38, 0.5)
  Top 0.203: v17.3,44.91 v17.3,41.3
  Top 0.254: v8.41,93.88 8.41,91.44 | 8.41,91.44 v8.41,88.85 8.41,87.83 arc90 9.83,86.41 13.23,86.41 arc-90 14.12,85.52 v14.12,81.23 | F1.2 9,91.44 8.41,91.44 | 6.1,91.59 C1.1 2.92,91.72 5V.TP | R23.2 v17.3,24.18 | v14.25,93.73 14.76,93.73 15.47,93.02 v15.47,90.7
  Top 0.406: F1.2 9.03,91.72 C1.1
  Bottom 0.203: C4.1 11.79,95.45 11.79,95.83 11.25,96.37 8.76,96.37 8.41,96.01 v8.41,93.88 | 17.3,57.25 v17.3,44.91 | v17.3,41.3 v17.3,24.18
  Bottom 0.254: C3.1 9.7,88.85 v8.41,88.85 8.41,90.53 8.82,91.04 U$1.1 | v15.47,90.7 15.47,89.61 R1.2 | U$1.7 13.81,93.29 v14.25,93.73 13.21,95.12 12.14,95.12 C4.1 | v17.3,24.18 17.3,22.02 arc90 18.72,20.6 R22.2 | v8.41,93.88 8.76,93.29 U$1.6 | 17.3,57.25 14.1,60.45 14.1,77.88 v14.12,81.23
+5V
  Top 0.254: F1.1 12.6,92.24 JP3.VBUS
CM_1V8  (via drill 0.38)
  Top 0.203: 16.96,71.17 U6.183 14.44,71.14 14.44,71.12 | 14.45,71.83 14.41,71.79 U6.185
  Top 0.254: v12.85,71.65 13.03,71.83 14.45,71.83 | 8.41,71.83 12.85,71.83 v12.85,71.65 | 8.41,71.83 8.23,72.01 6.45,72.01 6.39,72.07 U6.186 | C11.1 16.96,71.17 | 8.41,71.83 8.05,71.48 6.29,71.48 6.28,71.47 U6.184 | 14.44,71.12 13.03,71.12 12.85,71.3 v12.85,71.65
  Top 0.305: 6.29,71.48 6.27,71.48
  Bottom 0.254: R9.2 10.95,71.68 10.95,71.5 10.9,71.48 11.07,71.65 v12.85,71.65
CM_3V3  (via drill 0.38)
  Top 0.254: 17.07,74.17 C10.1 14.54,74.19 U6.193 14.46,74.27 11.2,74.27 10.82,73.89 10.8,73.89 | 10.8,73.89 11.07,73.61 14.45,73.61 14.48,73.64 U6.191 | 10.8,73.89 10.54,74.14 10.54,74.17 10.52,74.17 8.46,74.14 v7.9,74.47 7.42,73.86 U6.192 | 6.48,74.47 6.47,74.47 U6.194
  Top 0.305: 6.48,74.47 v7.9,74.47
  Bottom 0.305: v7.9,74.47 4.47,74.47 R8.2
CM_USB_DM
  Top 0.178: 14.57,66.45 15.52,66.45 15.72,66.24 19.58,66.24 20.6,65.23 20.6,49.78 21.62,48.77 27.91,48.77 27.99,48.84 U2.58
  Top 0.203: 14.57,66.45 14.49,66.37 U6.167
CM_USB_DP
  Top 0.178: 14.56,65.84 19.38,65.84 20.19,65.02 20.19,49.58 21.41,48.36 U2.59
  Top 0.203: 14.56,65.84 14.49,65.77 U6.165
CM_VBAT  (via drill 0.38)
  Top 0.203: 6.78,75.64 7.77,75.64 v7.87,75.74
  Top 0.254: 10.19,75.74 v7.87,75.74 7.87,75.92 7.52,76.28 6.3,76.28 6.29,76.27 U6.200 | 10.19,75.74 10.74,75.97 U6.199 14.99,76.05 15.06,75.97 15.97,75.97 C9.1 | 10.19,75.74 10.36,75.74 10.72,75.39 14.47,75.39 14.49,75.41 U6.197 | U6.198 6.24,75.64 6.78,75.64
  Bottom 0.254: 4.5,75.74 4.6,75.64 7.19,75.64 7.29,75.74 v7.87,75.74
  Bottom 0.305: 4.5,75.74 R7.2
CM_VDAC  (via drill 0.38)  (1 unrouted)
  Top 0.254: 14.45,72.9 10.54,72.9 10.19,73.25 v7.87,73.25 | 6.45,73.25 6.44,73.27 U6.190
  Top 0.305: 6.45,73.25 v7.87,73.25
  Bottom 0.254: R10.2 7.87,71.57 v7.87,73.25
DAC_2V5  (via drill 0.38)
  Top 0.203: v4.11,70.23 4.11,78.08 3.78,78.41 2V5.TP
  Bottom 0.203: v4.11,70.23 7.7,70.23 R10.1
  Bottom 0.254: U5.5 9.3,62.02 9.3,62.41 8.94,62.76 8.94,65.61 8.19,66.36 C48.1 8.23,67.78 8.23,68.45 7.77,68.91 R10.1
EMMC_DISABLE_N  (via drill 0.38)
  Top 0.203: v9.12,14.22 8.16,13.27 U6.2
  Bottom 0.254: v9.12,14.22 11.53,16.82 U3.3
GND  (via drill 0.38)
  Top 0.152: 7.65,36.83 7.59,36.26
  Top 0.178: C46.2 23.39,58.19 v23.39,59.05
  Top 0.203: v31.19,56.69 31.17,56.72 | C5.2 26.29,73.61 v28.42,73.61 29.54,73.61 C43.2 29.59,73.61 32.54,73.61 33.5,74.57 J1.10
  Top 0.254: U2.44 v31.19,56.69 | U2.34 36.2,54.51 35.43,55.3 C33.2 | U6.169 14.4,66.95 12.27,66.95 | U6.163 12.24,65.18
  Bottom 0.203: C19.2 C24.2 C20.2 29.51,41.48 C26.2 | C29.2 33.35,41.33
  pour Route2: 10.54,106.5 10.54,-8.36 47.35,-7.47 47.35,107.39
  pour Route15: -5.99,107.21 -5.99,-8.18 52.86,-8.18 52.86,107.21
  pour Top: 0.2,0.3 25.53,0.71 25.17,38.48 26.47,39.9 26.54,46.66 19.56,46.71 19.61,63.98 -0.38,63.98
  pour Top: 1.83,99.67 40.77,99.8 40.77,55.65 40.41,55.3 27.97,55.3 28.02,70.61 40.69,70.56 38,79.04 38.07,88.39 36.78,88.39 36.68,88.37 22.5,88.37 22.61,69.88
  pour Top: 0.18,99.62 -0.13,63.8 2.13,63.8 12.67,63.86 12.67,69.88 22.61,69.88 22.63,83.57 6.81,99.39
  pour Bottom: 36.14,81.43 36.14,87.48 35.97,87.66 24.61,87.66 22.45,85.52 22.45,78.77 1.65,78.77 1.57,78.89 1.57,99.34 40.77,99.72 36.4,88.27
  pour Bottom: 44.83,50.19 -4.32,50.65 -3.91,103.12 41.17,103.71 44.04,103.94 43.79,81.43
  pour Bottom: 26.19,7.65 33.35,7.67 33.35,43.21 38.81,43.21 38.81,55.47 40.59,55.47 40.59,0.53 26.01,0.53 26.19,0.71
  pour Bottom: 40.97,56.08 41.25,0.18 -0.13,0.18 -0.13,55.83
GPI047_CTL_1V8
  Bottom 0.254: R19.1 9.25,44.57 R20.1 9.23,46.56
GPIO47_1V8  (via drill 0.38)
  Top 0.203: U6.90 6.28,43.2 6.45,43.2
  Top 0.254: 6.45,43.2 v7.87,43.2
  Bottom 0.203: 9.19,43.2 9.23,43.24 R19.2
  Bottom 0.254: v7.87,43.2 9.19,43.2 9.37,43.03 | R19.2 arc90 9.3,43.17 9.32,36.83 11.53,34.62 U4.1
N$1
  Bottom 0.254: L1.P$1 15.75,92.84 U$1.8
N$2
  Bottom 0.254: U$1.4 8.41,92.38 8.17,92.62 R2.1 7.07,92.63 C51.2 5.55,92.64 R34.2
N$3
  Bottom 0.254: C2.1 14.16,88.2 R1.1 14.25,89.7 14.25,90.53 13.73,91.04 U$1.12
N$4
  Bottom 0.254: L2.P$1 6.98,91.49 U$1.2
N$5  (via drill 0.38)
  Top 0.203: 6.27,28.8 6.21,28.81 5.77,28.85 5.74,28.88 3.51,28.88 C12.1 2.36,28.8 1.12,30.05 1.12,64.19 2.54,65.08 v2.54,66.09
  Top 0.254: 6.27,28.8 6.35,28.88 10.41,28.88 10.73,28.57 U6.41 | U6.42 6.21,28.81
  Bottom 0.203: v2.54,66.09 2.54,67.21 2.9,67.21 R11.1 2.9,67.56
N$6
  Bottom 0.254: R35.2 19.98,91.69 C52.2 R3.1 15.94,91.68 15.67,91.95 U$1.10
N$7  (via drill 0.5)
  Top 0.254: PWR.A 5.04,97.16 4.32,97.16 v3.73,96.57
  Bottom 0.254: R6.1 5.37,95.99 4.39,95.99 3.81,96.57 v3.73,96.57
N$8  (via drill 0.38)
  Top 0.203: 3.43,24.66 C13.1 3.43,25.45 v3.43,27.03
  Top 0.254: U6.39 11.19,24.37 10.92,24.64 6.24,24.64 U6.40 3.43,24.67 3.43,24.66
  Bottom 0.203: R12.1 5.56,56.59 1.6,52.65 1.6,28.75 3.33,27.03 v3.43,27.03
N$9  (via drill 0.38)
  Top 0.254: v8.61,20.37 8.61,20.68 8.23,21.06 6.43,21.06 6.41,21.07 U6.28
  Bottom 0.254: v8.61,20.37 8.61,19.89 8.41,19.74 7.7,19.74 7.52,19.56 R15.1
N$10  (via drill 0.38)
  Top 0.254: v8.59,22.58 8.59,22.05 8.23,21.69 6.24,21.69 U6.30
  Bottom 0.254: v8.59,22.58 8.41,22.76 7.7,22.76 7.52,22.94 R14.1
N$11  (via drill 0.38)
  Top 0.203: U6.82 6.24,40.89 6.45,40.89
  Top 0.254: v11.25,40.36 10.9,40.72 8.41,40.72 8.23,40.89 6.45,40.89
  Bottom 0.254: R13.1 13.03,40.18 12.85,40.36 12.67,40.18 11.43,40.18 v11.25,40.36
N$12  (via drill 0.5)
  Top 0.203: 6.3,41.45 6.29,41.47 U6.84
  Top 0.254: 6.3,41.45 8.2,41.45 8.36,41.6 10.9,41.6 11.25,41.96 v11.28,41.96
  Bottom 0.254: R16.1 v11.28,41.96
N$13
  Top 0.203: R24.2 39.32,92.04 FDX.A
N$14  (via drill 0.38)
  Top 0.254: v1.12,66.32 1.12,94.89 1.71,95.49 ACT.C
  Bottom 0.254: 9.6,23.52 arc90 8.05,25.07 2.87,25.07 arc-90 1.14,26.8 1.14,27.38 v1.12,66.32 | 9.6,23.52 9.6,21.92 U3.2 | U4.3 9.6,23.57 9.6,23.52
N$15  (via drill 0.5)
  Top 0.254: ACT.A 2.84,98.73 2.95,98.63 v3.66,98.3
  Bottom 0.254: v3.66,98.3 4.19,98.04 R18.1
N$16
  Top 0.203: U2.63 28.5,46.41 26.72,46.41 26.3,45.99 R25.2
N$17  (via drill 0.38)
  Top 0.178: 14.54,69.32 R36.1 17.7,69.24 v17.7,67.82
  Top 0.203: 14.54,69.32 14.49,69.37 U6.177
  Bottom 0.178: C53.2 v17.7,67.82
N$18
  Top 0.254: JP4.1 3.25,64.54 4.83,66.12 6.24,66.12 6.24,66.1 U6.166
N$21
  Bottom 0.254: U5.4 7.87,62.02 C47.1
N$22  (via drill 0.38)
  Top 0.178: U2.62 28.5,46.91 25.55,46.91 25.4,46.76 v24.99,46.76
  Bottom 0.203: 21.73,50.49 21.73,50.37 21.74,50.37 C42.1 21.74,48.72 arc90 23.34,46.76 v24.99,46.76 | 21.73,50.49 BLM1.1 | C41.1 21.73,50.49
N$23  (via drill 0.38)
  Top 0.152: U2.48 29.21,54.03 29.21,54.05
  Top 0.203: 29.21,54 29.21,54.05 29.21,58.67 arc90 v27.79,60.1
  Bottom 0.203: BLM1.2 19.96,52.87 19.96,54.59 C39.1 | C39.1 20.18,54.8 | v27.79,60.1 21.21,60.1 arc90 20.14,59.03 C40.1 19.96,56.36 19.96,55.02 arc90 20.18,54.8 | 20.18,54.8 20.18,54.76 C39.1
N$24
  Top 0.178: 32.66,53.98 U2.41 32.69,54.59 32.59,54.69
  Top 0.203: 32.59,54.69 32.59,55.65 32.41,55.83 R26.2
N$25  (via drill 0.38)
  Top 0.178: U2.50 28.47,52.81 27.81,52.81
  Top 0.203: 27.81,52.81 arc-90 27.43,53.16 27.43,55.3 arc-90 v27.97,55.83
  Bottom 0.203: v27.97,55.83 29.39,55.83 arc90 29.92,56.36 R27.2
N$26  (via drill 0.38)
  Top 0.178: 38.1,51.38 38.07,51.36 U2.28
  Top 0.203: 38.1,51.38 38.28,51.38 arc90 38.81,51.92 v38.81,56.54
  Bottom 0.203: v38.81,56.54 38.63,56.9 38.63,57.61
  Bottom 0.254: 38.63,57.61 R29.1
N$27  (via drill 0.38)
  Top 0.203: J1.11 v34.32,81.46
  Bottom 0.203: v34.32,81.46 34.32,84.78 R32.1
N$28  (via drill 0.38)
  Top 0.203: J1.2 v25.17,81.58
  Bottom 0.203: R33.1 25.17,84.56 v25.17,81.58
N$29  (via drill 0.38)
  Top 0.203: v28.17,82.91 28.27,82.91 arc-90 28.83,82.14 28.83,80.31 | 28.83,80.31 29.24,79.7 J1.6 | J1.5 28.37,77.6 28.37,79.65 28.83,80.31
  Bottom 0.178: R31.2 28.32,65.47 C49.1
  Bottom 0.203: v28.17,82.91 arc90 27.05,81.99 27.05,69.19 C49.1
N$30
  Top 0.203: U2.20 arc-90 37.39,47.4 39.55,47.4 arc90 40.36,48.16 40.36,93.22 39.9,93.67 39.41,93.67 FDX.C
NLNK  (via drill 0.38)
  Top 0.178: v38.61,74.4 39.98,73 39.98,48.46 arc-90 39.4,47.85 U2.21
  Bottom 0.178: 32.97,85.02 32.99,84.97 32.99,79.98 v38.61,74.4
  Bottom 0.254: R32.2 32.97,85.02
NRST  (via drill 0.38)
  Top 0.178: U2.12 34.7,44.45 35.61,43.54 35.61,42.09 33.68,40.16 33.68,32.41 v31.72,30.43 | 14.49,18.97 16.71,18.97 v19.84,22.1
  Top 0.254: 14.49,18.97 U6.21
  Bottom 0.178: v31.72,30.43 28.52,27.2 24.92,27.2 v19.84,22.1
NSPD  (via drill 0.38)
  Top 0.178: U2.22 39.14,48.36 arc90 39.57,48.9 39.6,72.24 v37.9,73.79
  Bottom 0.178: v37.9,73.79 37.52,74.75 32.56,79.73 32.56,81.92 29.49,84.94 R33.2
RXD  (via drill 0.5)
  Top 0.203: v20.85,32.56 20.35,32.18 16.74,32.18 16.73,32.17 U6.53
  Bottom 0.203: v20.85,32.56 21.77,32.56 24.21,34.95 37.62,34.95 37.64,34.92 JP1.1
RXN
  Top 0.152: U2.53 arc90 28.5,51.41 27.31,51.41 arc-90 26.09,52.63 26.09,58.32 | 26.09,58.32 26.09,71.12 arc-90 27.1,72.14 29.54,72.14 | 29.54,72.14 33.4,72.14 arc90 35.03,73.76 35.03,81.89 arc90 34.21,82.7 33.22,82.7 arc88 32.92,82.32 arc-185 32.39,82.3 arc90 31.98,82.7 arc90 30.96,81.69 30.96,80.06 31.27,79.76 J1.8 | C43.1 29.54,72.72 29.54,72.14 | R30.2 25.3,58.32 26.09,58.32
RXP
  Top 0.152: U2.52 28.5,51.82 27.31,51.82 arc-90 26.49,52.63 26.49,58.32 | 26.49,58.32 26.49,70.92 arc-90 27.31,71.73 29.54,71.73 | 29.54,71.73 33.4,71.73 arc90 35.43,73.76 35.43,81.89 arc90 34.21,83.11 31.78,83.11 arc90 30.56,81.89 30.56,80.06 30.25,79.76 J1.7 | C16.1 29.54,71.04 29.54,71.73 | R21.2 27.28,58.32 26.49,58.32
TXD  (via drill 0.5)
  Top 0.203: v20.9,31.32 20.43,31.57 U6.51
  Bottom 0.203: v20.9,31.32 21.36,31.32 24.51,34.54 36.12,34.54 36.65,34.01 36.65,32.99 37.26,32.38 JP1.2
TXN
  Top 0.152: 27.36,77.5 arc90 J1.4 27.2,79.88 26.9,80.19 26.9,82.7 arc90 25.88,83.72 25.07,83.72 arc90 24.05,82.7 24.05,73.36 | 24.05,54.05 24.05,51.21 arc90 25.07,49.99 27.91,49.99 28.32,49.78 28.47,49.78 U2.56 | 24.05,54.05 24.05,73.36 | C7.1 arc90 23.42,73.36 24.05,73.36 | R17.2 23.32,54.05 24.05,54.05
TXP
  Top 0.152: U2.55 28.52,50.39 25.27,50.39 arc-90 24.46,51.21 24.46,54.05 | 24.46,54.05 24.46,73.36 | 24.46,73.36 24.46,82.7 arc-90 25.07,83.31 25.88,83.31 arc-90 26.49,82.7 arc-90 26.29,82.5 arc180 26.29,82.09 arc-180 26.29,81.69 arc180 26.29,81.28 arc-180 26.29,80.87 arc180 26.29,80.47 arc-127 26.47,80.06 26.29,79.86 26.29,77.55 J1.3 | C5.1 arc-90 25.1,73.36 24.46,73.36 | R5.2 25.3,54.05 24.46,54.05
USBDM2
  Top 0.178: U2.1 29.13,45.16 29.13,19.3 29.95,18.49 29.95,12.6 29.1,11.75 USB1.A2_D-
USBDM3
  Top 0.178: U2.3 30.15,45.16 30.15,19.71 32.18,17.68 32.18,11.46 arc-90 31.22,10.49 30.56,10.49 arc90 29.97,9.91 29.97,9.81 arc-90 USB1.B2_D-
USBDP2
  Top 0.178: U2.2 29.74,45.16 29.74,44.7 29.54,44.5 29.54,19.51 30.35,18.69 30.35,12.6 31.1,11.85 USB1.A3_D+
USBDP3
  Top 0.178: U2.4 30.76,45.14 30.76,44.7 30.56,44.5 30.56,19.91 32.54,17.91 32.54,11.4 arc-90 31.29,10.13 30.66,10.13 arc90 30.33,9.83 30.33,9.71 arc90 USB1.B3_D+
VCC_USB2
  Bottom 0.254: 24.28,16.59 24.18,16.48 C14.1
  Bottom 0.813: R22.1 24.28,20.58 C44.1 24.18,18.39 C14.1 24.56,15.8 24.61,15.85 24.94,15.85 26.6,14.19 USB1.A1_5V+
VCC_USB3
  Top 0.254: R23.1 24.16,24.2
  Top 0.813: R23.1 23.95,24.14 C50.1 23.93,22.05 C15.1 23.95,19.05 23.95,17.68 20.12,13.84 20.12,11.38 22.56,8.94 USB1.B1_5V+
VDD18CORE  (via drill 0.38)
  Top 0.203: v39.88,43.38 arc-90 39.17,42.67 36.86,42.67 arc-90 36.2,43.36 U2.15 | v38.63,62.23 36.8,62.23 | 36.8,62.23 35.43,62.23 | 35.43,62.23 35.03,62.23 34.19,61.39 34.19,60.27 C36.1 34.19,59.92 U2.38 | C30.1 35.43,62.23 | C31.1 36.8,62.38 36.8,62.23
  Bottom 0.203: v39.88,43.38 39.88,60.98 arc90 v38.63,62.23
XI  (1 unrouted)
  Top 0.178: 28.47,47.3 27.97,47.3 27.79,47.47 24.41,47.47 24.05,47.12 R28.1
  Top 0.203: Y1.3 23.19,44.22 C37.1 23.22,45.44 23.22,45.54 23.19,45.57 23.19,46.51 23.46,46.78 R28.1
XO
  Top 0.178: U2.60 22.76,47.85 22.16,47.18 R28.2
  Top 0.203: R28.2 20.55,45.66 C38.1 21.56,44.4 21.56,42.75 20.21,41.4 Y1.1

### Text on the board
tNames: JP1 | ACT | PWR | F1 | J1 | C1 | R24 | FDX | FDX | FDX | C9 | C7 | C5 | C43 | C10 | C16 | C11 | R36 | C30 | C31 | C36 | C46 | R30 | R21 | C34 | TVDAC | R26 | C33 | R17 | R5 | R28 | R25 | C38 | C37 | C28 | C27 | Y1 | RXD | TXD | TTL Serial | GND | C12 | R23 | C13 | C50 | C15 | USB1
bNames: R18 | C6 | R6 | C4 | R34 | C51 | R2 | L1 | U$1 | C3 | R1 | R3 | C52 | R35 | L2 | C2 | C8 | R33 | R32 | R7 | R8 | R9 | R10 | R11 | C49 | C48 | R31 | R12 | C47 | C23 | BLM | R4 | U5 | R29 | C45 | C23 | R27 | C40 | C35 | C21 | C39 | C25 | BLM1 | C18 | C41 | C17 | C42 | C22 | R20 | R19 | R16 | C29 | C26 | C20 | C24 | C19 | C32 | R13 | R14 | R22 | R15 | C44 | C14